# Altium schematic sheet Altera_ArriaGX_PCIExpress.SchDoc
size B; DocumentNumber: 1; SheetNumber: 1; SheetTotal: 1
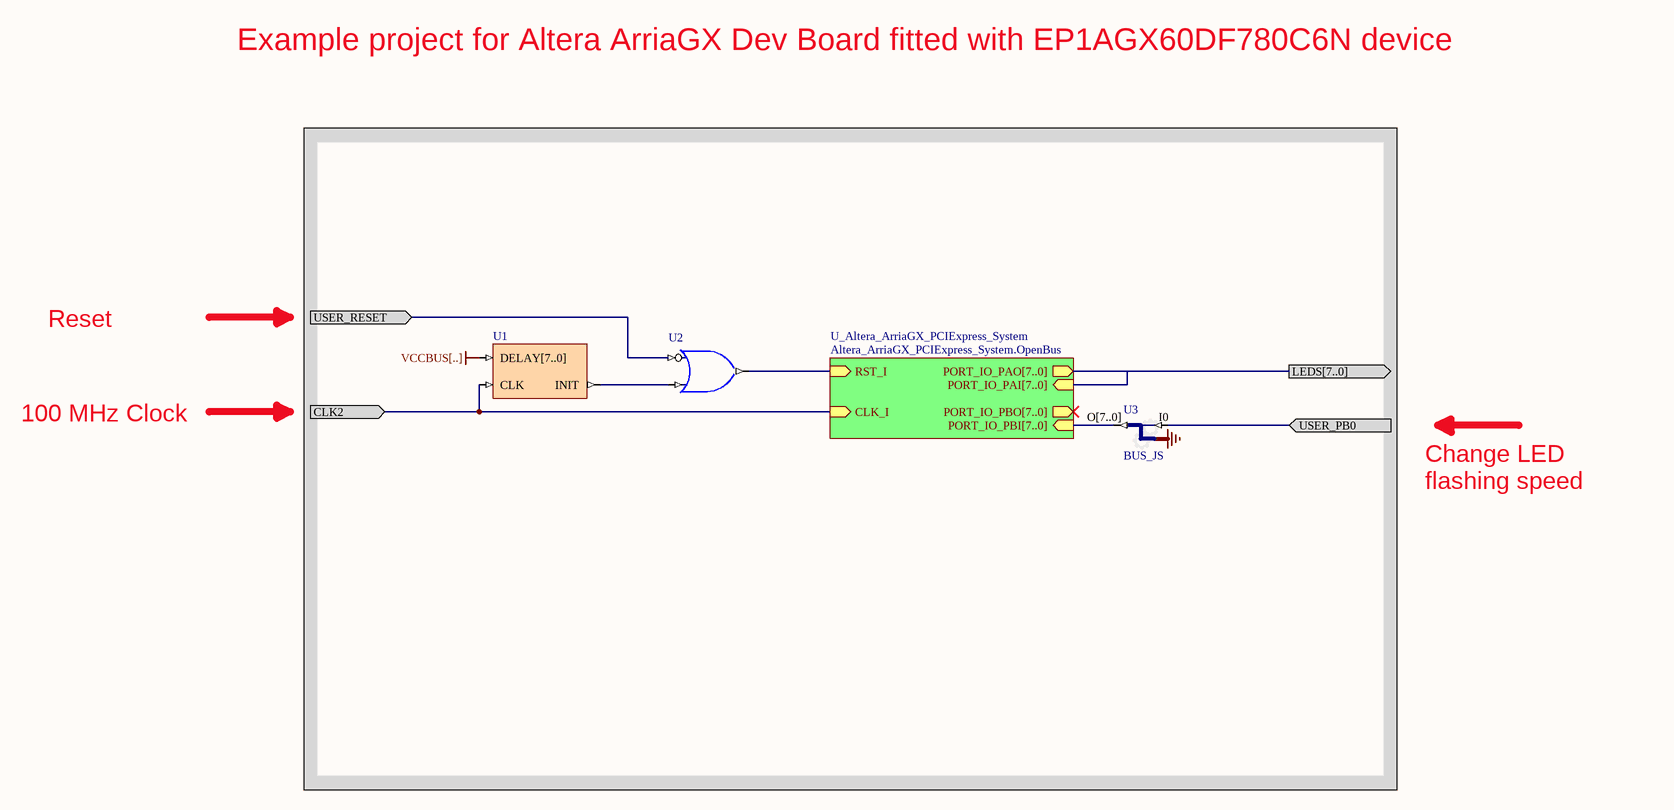
[diagram p0: Altera_ArriaGX_PCIExpress.SchDoc]

## Parts
U1  FPGA_STARTUP8  (value not drawn)
U2  OR2N1S  (value not drawn)
U3  BUS_JS

## Sub-sheets
U_Altera_ArriaGX_PCIExpress_System = Altera_ArriaGX_PCIExpress_System.OpenBus: RST_I (in), CLK_I (in), PORT_IO_PBI[7..0] (in), PORT_IO_PBO[7..0] (out), PORT_IO_PAI[7..0] (in), PORT_IO_PAO[7..0] (out)

## Ports
CLK2 (in, see AC15), LEDS[7..0] (out, see C12,C14,B14,A13,B13,C13,A11,A12), USER_PB0 (in, see A19), USER_RESET (in, see AE17)

## Nets
GND_BUS[6..0]: U3.I1_B[6..0]
VCCBUS[..]: U1.DELAY[7..0]
CLK2: U1.CLK ; port CLK2, sheet U_Altera_ArriaGX_PCIExpress_System/CLK_I
USER_PB0: U3.I0 ; port USER_PB0
USER_RESET: U2.I0 ; port USER_RESET
NetU1_INIT: U1.INIT U2.I1
NetU2_O: U2.O ; sheet U_Altera_ArriaGX_PCIExpress_System/RST_I
NetU3_O[7..0]: U3.O[7..0] ; sheet U_Altera_ArriaGX_PCIExpress_System/PORT_IO_PBI[7..0]

## Buses and harness runs
bus port LEDS[7..0] = sheet U_Altera_ArriaGX_PCIExpress_System/PORT_IO_PAI[7..0] = sheet U_Altera_ArriaGX_PCIExpress_System/PORT_IO_PAO[7..0]

## Notes on the sheet
- Example project for Altera ArriaGX Dev Board fitted with EP1AGX60DF780C6N device
- Reset
- 100 MHz Clock
- Change LED flashing speed
- Title
- Size:
- Date:
- B
- Number:
- Time:
- Revision:
- Sheet
- of
- File:

## Library data of the parts
U1 = FPGA_STARTUP8: FPGA Startup With 8 Bit Delay; Published: 9-Dec-2004; Publisher: Altium Limited; HelpURL: CR0119 FPGA_STARTUPx Powerup Delay Unit.pdf; LastRevisionNo: 1.00.00; ComponentLink1Description: Core &Resource Usage; ComponentLink1URL: CR0139 FPGA Peripheral Resource Usage.pdf#page=11
U2 = OR2N1S: 2-Input OR Gate with Active Low A Input, Single Pin Version; XilinxEquivalent: OR2B1; FunctionalClass: Logic Primitive; PortSize: 2; ArchiveName: GENERIC; VHDLIB_SIM: GENERIC_LIB; Published: 29-Jan-2004; Publisher: Altium Limited; LastRevisionNo: 1.00.00; HelpURL: CR0118 FPGA Generic Library Guide.pdf#page=410; ComponentLink1URL: CR0136 FPGA Logic Primitive Resource Usage.pdf#page=187; ComponentLink1Description: Core &Resource Usage; SubClass: OR; PortStyle: Single Pin Version
U3 = BUS_JS: Configurable Bus Joiner/Splitter; ConfiguratorName: GENERIC_BUS_JS; ConfigurationParameters: {}Version[1.1]{}SplitterJoinerType[Joiner]{}SignalCount[2]{}SignalWidth0[1]{}GapBelow0[1000000]{}ConnectionType0[Pin]{}SignalWidth1[7]{}GapBelow1[1000000]{}ConnectionType1[GND]{}ShowPinNames[True]{}; LastRevisionNo: 1.00.00; Published: 17-Sep-2008; Publisher: Altium Limited